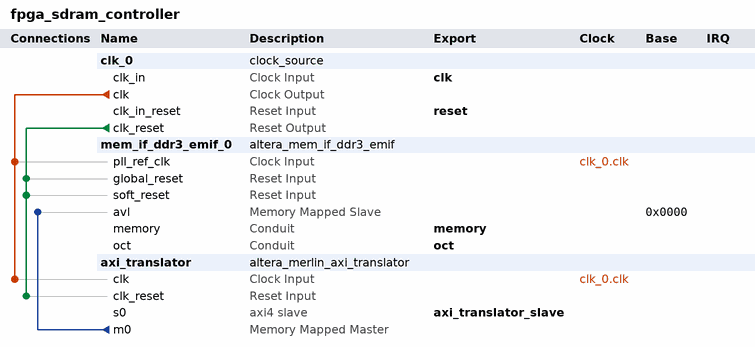
[diagram p0: system contents]
# Platform Designer (Qsys) system fpga_sdram_controller, Cyclone V 5CSXFC6D6F31C8ES
# Parameters at their usual value, and those the tool derives, are not listed.
package require -exact qsys 13.0
create_system fpga_sdram_controller
set_project_property DEVICE_FAMILY {Cyclone V}
set_project_property DEVICE 5CSXFC6D6F31C8ES

add_instance clk_0 clock_source 13.0
set_instance_parameter_value clk_0 clockFrequency 50000000

add_instance mem_if_ddr3_emif_0 altera_mem_if_ddr3_emif 13.0
set_instance_parameter_value mem_if_ddr3_emif_0 MEM_VENDOR JEDEC
set_instance_parameter_value mem_if_ddr3_emif_0 MEM_FORMAT DISCRETE
set_instance_parameter_value mem_if_ddr3_emif_0 MEM_CLK_FREQ_MAX 400.0
set_instance_parameter_value mem_if_ddr3_emif_0 MEM_ROW_ADDR_WIDTH 13
set_instance_parameter_value mem_if_ddr3_emif_0 MEM_COL_ADDR_WIDTH 10
set_instance_parameter_value mem_if_ddr3_emif_0 MEM_DQ_WIDTH 32
set_instance_parameter_value mem_if_ddr3_emif_0 MEM_BANKADDR_WIDTH 3
set_instance_parameter_value mem_if_ddr3_emif_0 MEM_DRV_STR RZQ/6
set_instance_parameter_value mem_if_ddr3_emif_0 MEM_RTT_NOM {ODT Disabled}
set_instance_parameter_value mem_if_ddr3_emif_0 MEM_RTT_WR {Dynamic ODT off}
set_instance_parameter_value mem_if_ddr3_emif_0 MEM_WTCL 6
set_instance_parameter_value mem_if_ddr3_emif_0 MEM_TCL 7
set_instance_parameter_value mem_if_ddr3_emif_0 TIMING_TIS 175
set_instance_parameter_value mem_if_ddr3_emif_0 TIMING_TIH 250
set_instance_parameter_value mem_if_ddr3_emif_0 TIMING_TDS 50
set_instance_parameter_value mem_if_ddr3_emif_0 TIMING_TDH 125
set_instance_parameter_value mem_if_ddr3_emif_0 TIMING_TDQSQ 120
set_instance_parameter_value mem_if_ddr3_emif_0 TIMING_TDQSCK 400
set_instance_parameter_value mem_if_ddr3_emif_0 TIMING_TDQSS 0.25
set_instance_parameter_value mem_if_ddr3_emif_0 TIMING_TQSH 0.38
set_instance_parameter_value mem_if_ddr3_emif_0 TIMING_TDSH 0.2
set_instance_parameter_value mem_if_ddr3_emif_0 TIMING_TDSS 0.2
set_instance_parameter_value mem_if_ddr3_emif_0 MEM_TINIT_US 499
set_instance_parameter_value mem_if_ddr3_emif_0 MEM_TMRD_CK 3
set_instance_parameter_value mem_if_ddr3_emif_0 MEM_TRAS_NS 40.0
set_instance_parameter_value mem_if_ddr3_emif_0 MEM_TRCD_NS 15.0
set_instance_parameter_value mem_if_ddr3_emif_0 MEM_TRP_NS 15.0
set_instance_parameter_value mem_if_ddr3_emif_0 MEM_TREFI_US 7.0
set_instance_parameter_value mem_if_ddr3_emif_0 MEM_TRFC_NS 75.0
set_instance_parameter_value mem_if_ddr3_emif_0 MEM_TWTR 2
set_instance_parameter_value mem_if_ddr3_emif_0 MEM_TFAW_NS 37.5
set_instance_parameter_value mem_if_ddr3_emif_0 MEM_TRRD_NS 7.5
set_instance_parameter_value mem_if_ddr3_emif_0 MEM_TRTP_NS 7.5
set_instance_parameter_value mem_if_ddr3_emif_0 RATE Half
set_instance_parameter_value mem_if_ddr3_emif_0 MEM_CLK_FREQ 300.0
set_instance_parameter_value mem_if_ddr3_emif_0 SPEED_GRADE 8
set_instance_parameter_value mem_if_ddr3_emif_0 HARD_EMIF false
set_instance_parameter_value mem_if_ddr3_emif_0 POWER_OF_TWO_BUS false
set_instance_parameter_value mem_if_ddr3_emif_0 AVL_MAX_SIZE 32
set_instance_parameter_value mem_if_ddr3_emif_0 PRIORITY_PORT 1,1,1,1,1,1
set_instance_parameter_value mem_if_ddr3_emif_0 CPORT_TYPE_PORT Bidirectional,Bidirectional,Bidirectional,Bidirectional,Bidirectional,Bidirectional
set_instance_parameter_value mem_if_ddr3_emif_0 REF_CLK_FREQ 50.0
set_instance_parameter_value mem_if_ddr3_emif_0 DEFAULT_FAST_SIM_MODEL true
set_instance_parameter_value mem_if_ddr3_emif_0 EXPORT_AFI_HALF_CLK false
set_instance_parameter_value mem_if_ddr3_emif_0 PLL_LOCATION Top_Bottom
set_instance_parameter_value mem_if_ddr3_emif_0 CALIBRATION_MODE Skip
set_instance_parameter_value mem_if_ddr3_emif_0 USER_DEBUG_LEVEL 1
set_instance_parameter_value mem_if_ddr3_emif_0 TIMING_BOARD_MAX_CK_DELAY 0.6
set_instance_parameter_value mem_if_ddr3_emif_0 TIMING_BOARD_MAX_DQS_DELAY 0.6
set_instance_parameter_value mem_if_ddr3_emif_0 TIMING_BOARD_SKEW_CKDQS_DIMM_MIN -0.01
set_instance_parameter_value mem_if_ddr3_emif_0 TIMING_BOARD_SKEW_CKDQS_DIMM_MAX 0.01
set_instance_parameter_value mem_if_ddr3_emif_0 TIMING_BOARD_SKEW_WITHIN_DQS 0.02
set_instance_parameter_value mem_if_ddr3_emif_0 TIMING_BOARD_SKEW_BETWEEN_DQS 0.02
set_instance_parameter_value mem_if_ddr3_emif_0 TIMING_BOARD_DQ_TO_DQS_SKEW 0.0
set_instance_parameter_value mem_if_ddr3_emif_0 TIMING_BOARD_AC_SKEW 0.02
set_instance_parameter_value mem_if_ddr3_emif_0 TIMING_BOARD_AC_TO_CK_SKEW 0.0

add_instance axi_translator altera_merlin_axi_translator 1.0
set_instance_parameter_value axi_translator USE_S0_AWID 1
set_instance_parameter_value axi_translator USE_S0_AWREGION 0
set_instance_parameter_value axi_translator USE_M0_AWREGION 1
set_instance_parameter_value axi_translator USE_S0_AWLEN 1
set_instance_parameter_value axi_translator USE_S0_AWSIZE 1
set_instance_parameter_value axi_translator USE_S0_AWBURST 1
set_instance_parameter_value axi_translator USE_S0_AWLOCK 1
set_instance_parameter_value axi_translator USE_M0_AWLOCK 1
set_instance_parameter_value axi_translator USE_S0_AWCACHE 1
set_instance_parameter_value axi_translator USE_M0_AWCACHE 1
set_instance_parameter_value axi_translator USE_M0_AWPROT 1
set_instance_parameter_value axi_translator USE_S0_AWQOS 0
set_instance_parameter_value axi_translator USE_M0_AWQOS 1
set_instance_parameter_value axi_translator USE_S0_WSTRB 1
set_instance_parameter_value axi_translator USE_M0_WLAST 1
set_instance_parameter_value axi_translator USE_S0_BID 1
set_instance_parameter_value axi_translator USE_S0_BRESP 1
set_instance_parameter_value axi_translator USE_M0_BRESP 1
set_instance_parameter_value axi_translator USE_S0_ARID 1
set_instance_parameter_value axi_translator USE_S0_ARREGION 0
set_instance_parameter_value axi_translator USE_M0_ARREGION 1
set_instance_parameter_value axi_translator USE_S0_ARLEN 1
set_instance_parameter_value axi_translator USE_S0_ARSIZE 1
set_instance_parameter_value axi_translator USE_S0_ARBURST 1
set_instance_parameter_value axi_translator USE_S0_ARLOCK 1
set_instance_parameter_value axi_translator USE_M0_ARLOCK 1
set_instance_parameter_value axi_translator USE_M0_ARCACHE 1
set_instance_parameter_value axi_translator USE_M0_ARQOS 1
set_instance_parameter_value axi_translator USE_M0_ARPROT 1
set_instance_parameter_value axi_translator USE_S0_ARCACHE 1
set_instance_parameter_value axi_translator USE_S0_ARQOS 0
set_instance_parameter_value axi_translator USE_S0_RID 1
set_instance_parameter_value axi_translator USE_S0_RRESP 1
set_instance_parameter_value axi_translator USE_M0_RRESP 1
set_instance_parameter_value axi_translator USE_S0_RLAST 1
set_instance_parameter_value axi_translator M0_ID_WIDTH 8
set_instance_parameter_value axi_translator DATA_WIDTH 32
set_instance_parameter_value axi_translator S0_ID_WIDTH 4
set_instance_parameter_value axi_translator M0_ADDR_WIDTH 32
set_instance_parameter_value axi_translator S0_WRITE_ADDR_USER_WIDTH 64
set_instance_parameter_value axi_translator S0_READ_ADDR_USER_WIDTH 64
set_instance_parameter_value axi_translator M0_WRITE_ADDR_USER_WIDTH 64
set_instance_parameter_value axi_translator M0_READ_ADDR_USER_WIDTH 64
set_instance_parameter_value axi_translator S0_WRITE_DATA_USER_WIDTH 64
set_instance_parameter_value axi_translator S0_WRITE_RESPONSE_DATA_USER_WIDTH 64
set_instance_parameter_value axi_translator S0_READ_DATA_USER_WIDTH 64
set_instance_parameter_value axi_translator M0_WRITE_DATA_USER_WIDTH 64
set_instance_parameter_value axi_translator M0_WRITE_RESPONSE_DATA_USER_WIDTH 64
set_instance_parameter_value axi_translator M0_READ_DATA_USER_WIDTH 64
set_instance_parameter_value axi_translator S0_ADDR_WIDTH 32
set_instance_parameter_value axi_translator USE_S0_AWUSER 0
set_instance_parameter_value axi_translator USE_S0_ARUSER 0
set_instance_parameter_value axi_translator USE_S0_WUSER 0
set_instance_parameter_value axi_translator USE_S0_RUSER 0
set_instance_parameter_value axi_translator USE_S0_BUSER 0
set_instance_parameter_value axi_translator USE_M0_AWUSER 0
set_instance_parameter_value axi_translator USE_M0_ARUSER 0
set_instance_parameter_value axi_translator USE_M0_WUSER 0
set_instance_parameter_value axi_translator USE_M0_RUSER 0
set_instance_parameter_value axi_translator USE_M0_BUSER 0
set_instance_parameter_value axi_translator M0_AXI_VERSION AXI4
set_instance_parameter_value axi_translator S0_AXI_VERSION AXI4
set_instance_parameter_value axi_translator WRITE_ISSUING_CAPABILITY 16
set_instance_parameter_value axi_translator READ_ISSUING_CAPABILITY 16
set_instance_parameter_value axi_translator COMBINED_ISSUING_CAPABILITY 16
set_instance_parameter_value axi_translator WRITE_ACCEPTANCE_CAPABILITY 16
set_instance_parameter_value axi_translator READ_ACCEPTANCE_CAPABILITY 16
set_instance_parameter_value axi_translator COMBINED_ACCEPTANCE_CAPABILITY 16
set_instance_parameter_value axi_translator READ_DATA_REORDERING_DEPTH 1

# connections
add_connection clk_0.clk axi_translator.clk clock
add_connection clk_0.clk mem_if_ddr3_emif_0.pll_ref_clk clock
add_connection clk_0.clk_reset axi_translator.clk_reset reset
add_connection clk_0.clk_reset mem_if_ddr3_emif_0.global_reset reset
add_connection clk_0.clk_reset mem_if_ddr3_emif_0.soft_reset reset
add_connection axi_translator.m0 mem_if_ddr3_emif_0.avl avalon
set_connection_parameter_value axi_translator.m0/mem_if_ddr3_emif_0.avl baseAddress 0x0000

# exported interfaces
add_interface clk clock sink
set_interface_property clk EXPORT_OF clk_0.clk_in
add_interface reset reset sink
set_interface_property reset EXPORT_OF clk_0.clk_in_reset
add_interface memory conduit end
set_interface_property memory EXPORT_OF mem_if_ddr3_emif_0.memory
add_interface oct conduit end
set_interface_property oct EXPORT_OF mem_if_ddr3_emif_0.oct
add_interface axi_translator_slave axi4 slave
set_interface_property axi_translator_slave EXPORT_OF axi_translator.s0

set_interconnect_requirement {$system} qsys_mm.clockCrossingAdapter HANDSHAKE
set_interconnect_requirement {$system} qsys_mm.maxAdditionalLatency 1

save_system fpga_sdram_controller.qsys
